# Altium project Pedal_Jacks.PrjPcb
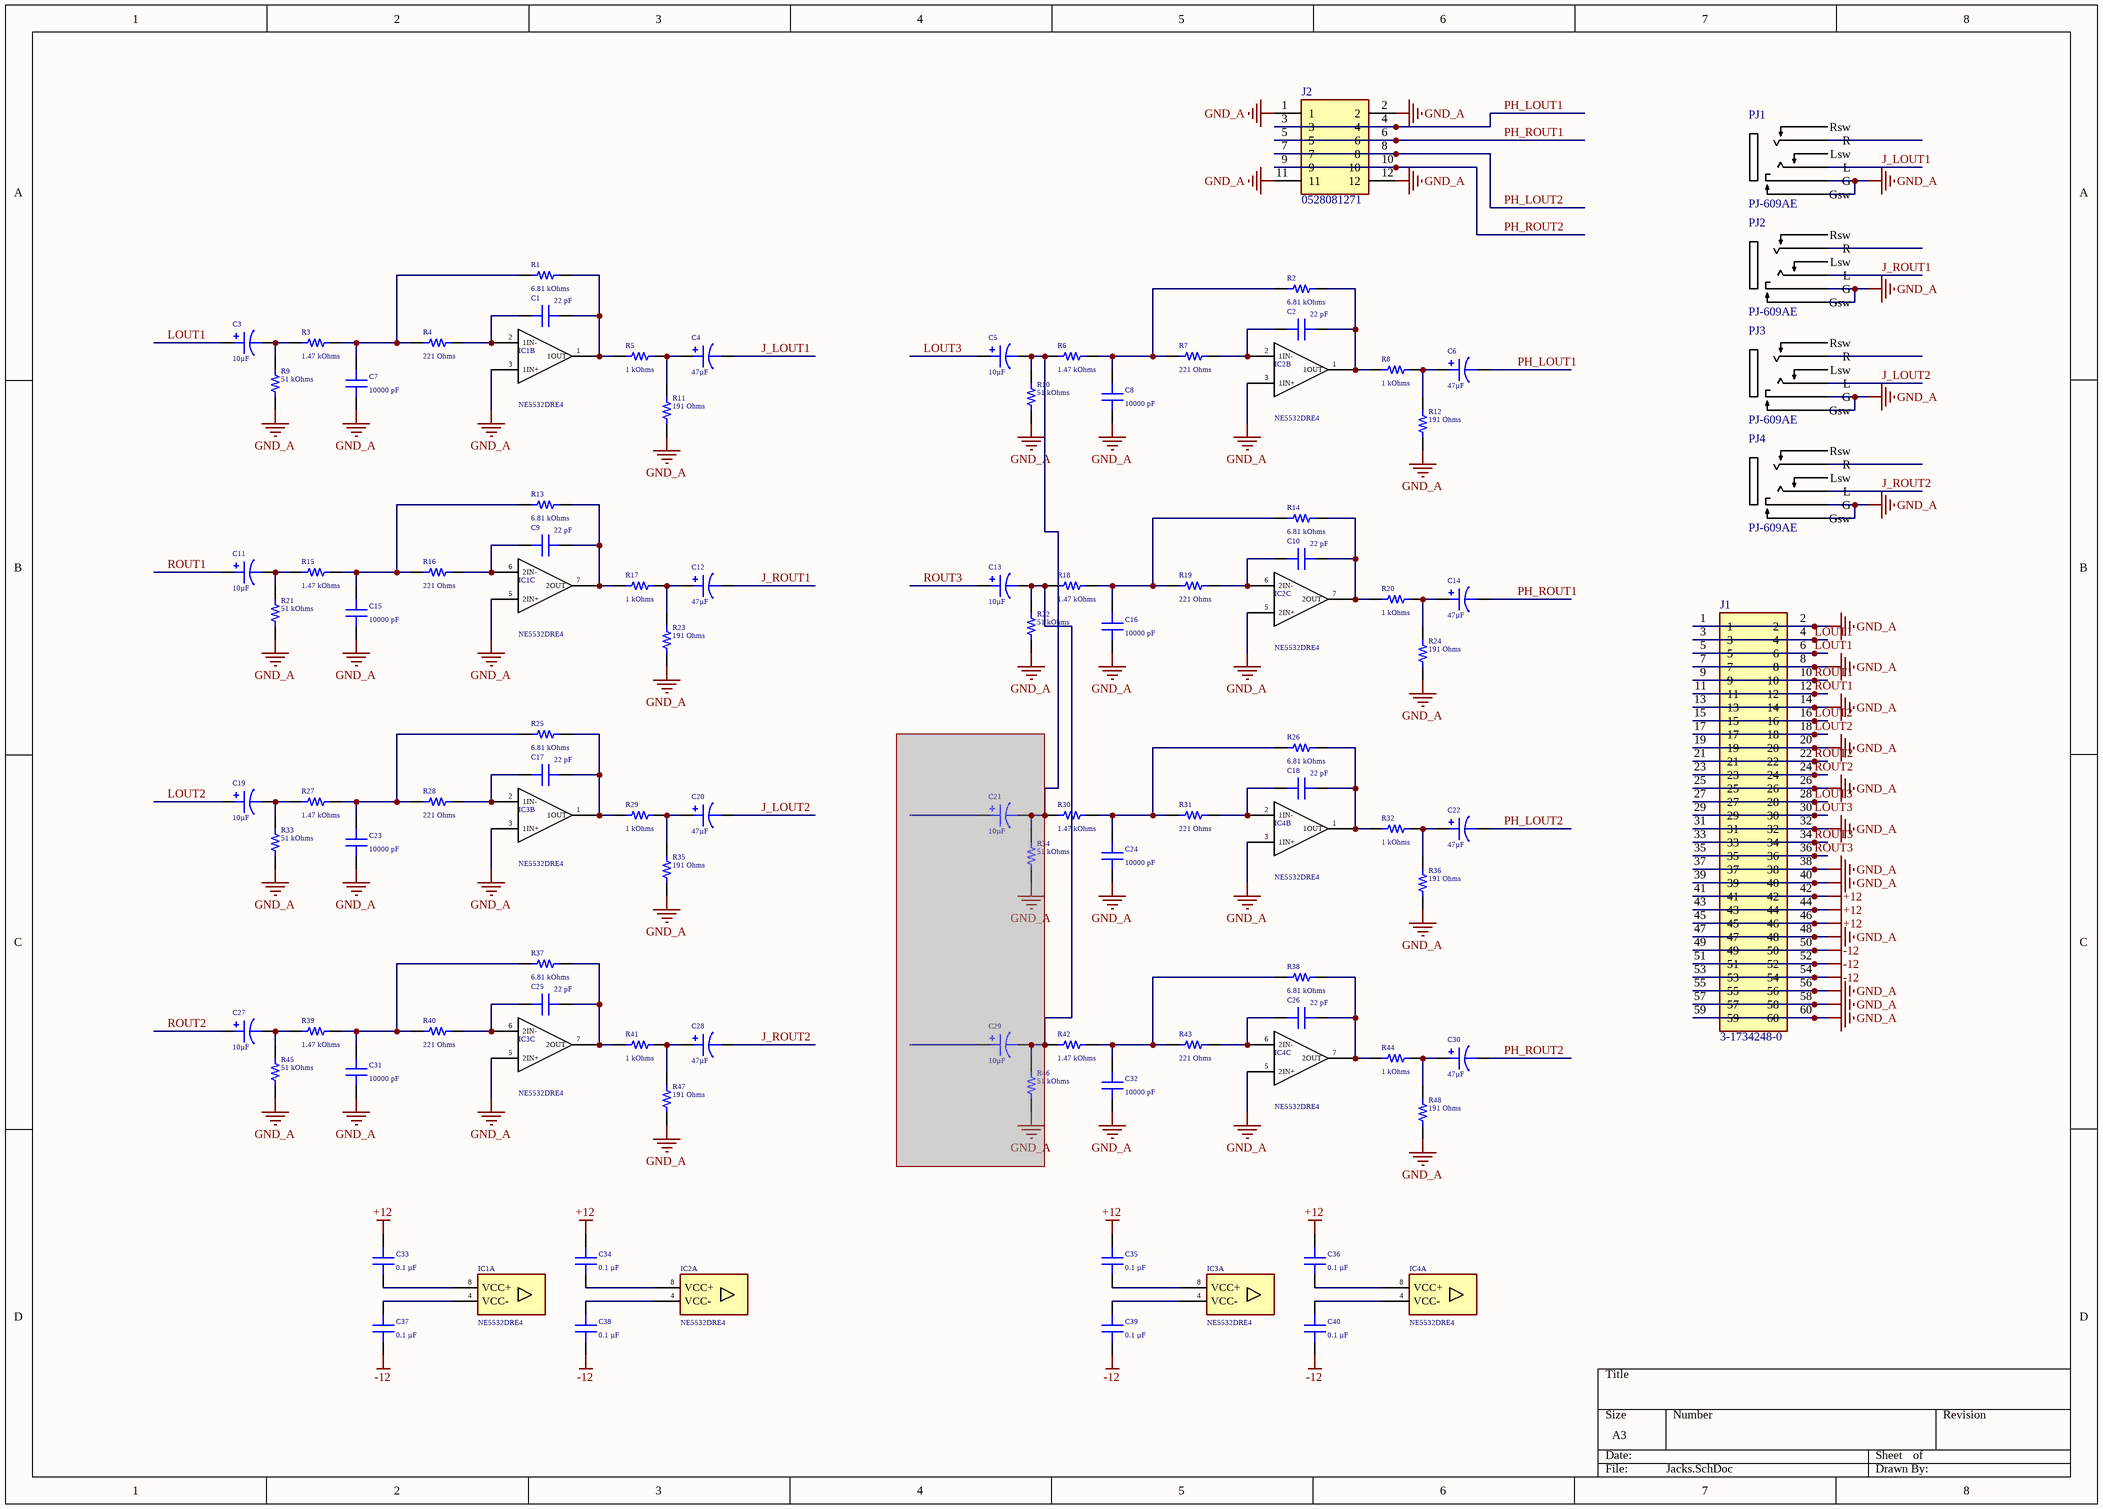
[diagram p0: Jacks.SchDoc]
1 sheet, 98 parts. Net scope: global (net labels, ports and power ports of the same name join across sheets).
Board files: Jacks_old_old.PcbDoc, Jacks_old.PcbDoc, Jacks.PcbDoc

## Sheet Jacks.SchDoc
size A3; SheetNumber: 1; SheetTotal: 1

### Parts
C1  22 pF  [CAP 0603_1608]
C2  22 pF  [CAP 0603_1608]
C3  10µF  [CAP POL 1206_3216]
C4  47µF  [CAP POL 2917_7343]
C5  10µF  [CAP POL 1206_3216]
C6  47µF  [CAP POL 2917_7343]
C7  10000 pF  [MURATA GRM188 0603_1608]
C8  10000 pF  [MURATA GRM188 0603_1608]
C9  22 pF  [CAP 0603_1608]
C10  22 pF  [CAP 0603_1608]
C11  10µF  [CAP POL 1206_3216]
C12  47µF  [CAP POL 2917_7343]
C13  10µF  [CAP POL 1206_3216]
C14  47µF  [CAP POL 2917_7343]
C15  10000 pF  [MURATA GRM188 0603_1608]
C16  10000 pF  [MURATA GRM188 0603_1608]
C17  22 pF  [CAP 0603_1608]
C18  22 pF  [CAP 0603_1608]
C19  10µF  [CAP POL 1206_3216]
C20  47µF  [CAP POL 2917_7343]
C21  10µF  [CAP POL 1206_3216]  (masked out: inside a compile mask, not in the netlist)
C22  47µF  [CAP POL 2917_7343]
C23  10000 pF  [MURATA GRM188 0603_1608]
C24  10000 pF  [MURATA GRM188 0603_1608]
C25  22 pF  [CAP 0603_1608]
C26  22 pF  [CAP 0603_1608]
C27  10µF  [CAP POL 1206_3216]
C28  47µF  [CAP POL 2917_7343]
C29  10µF  [CAP POL 1206_3216]  (masked out: inside a compile mask, not in the netlist)
C30  47µF  [CAP POL 2917_7343]
C31  10000 pF  [MURATA GRM188 0603_1608]
C32  10000 pF  [MURATA GRM188 0603_1608]
C33  0.1 µF  [CAP 0603_1608]
C34  0.1 µF  [CAP 0603_1608]
C35  0.1 µF  [CAP 0603_1608]
C36  0.1 µF  [CAP 0603_1608]
C37  0.1 µF  [CAP 0603_1608]
C38  0.1 µF  [CAP 0603_1608]
C39  0.1 µF  [CAP 0603_1608]
C40  0.1 µF  [CAP 0603_1608]
IC1  NE5532DRE4  [SOIC127P600X175-8N]  (parts A,B,C of 3)
IC2  NE5532DRE4  [SOIC127P600X175-8N]  (parts A,B,C of 3)
IC3  NE5532DRE4  [SOIC127P600X175-8N]  (parts A,B,C of 3)
IC4  NE5532DRE4  [SOIC127P600X175-8N]  (parts A,B,C of 3)
J1  3-1734248-0  [317342480]
J2  0528081271  [AFA11-S12GLA-00]
PJ1  PJ-609AE  [PJ609AE]
PJ2  PJ-609AE  [PJ609AE]
PJ3  PJ-609AE  [PJ609AE]
PJ4  PJ-609AE  [PJ609AE]
R1  6.81 kOhms  [YAGEO RES 0603_1608]
R2  6.81 kOhms  [YAGEO RES 0603_1608]
R3  1.47 kOhms  [YAGEO RES 0603_1608]
R4  221 Ohms  [YAGEO RES 0603_1608]
R5  1 kOhms  [YAGEO RES 0603_1608]
R6  1.47 kOhms  [YAGEO RES 0603_1608]
R7  221 Ohms  [YAGEO RES 0603_1608]
R8  1 kOhms  [YAGEO RES 0603_1608]
R9  51 kOhms  [YAGEO RES 0603_1608]
R10  51 kOhms  [YAGEO RES 0603_1608]
R11  191 Ohms  [YAGEO RES 0603_1608]
R12  191 Ohms  [YAGEO RES 0603_1608]
R13  6.81 kOhms  [YAGEO RES 0603_1608]
R14  6.81 kOhms  [YAGEO RES 0603_1608]
R15  1.47 kOhms  [YAGEO RES 0603_1608]
R16  221 Ohms  [YAGEO RES 0603_1608]
R17  1 kOhms  [YAGEO RES 0603_1608]
R18  1.47 kOhms  [YAGEO RES 0603_1608]
R19  221 Ohms  [YAGEO RES 0603_1608]
R20  1 kOhms  [YAGEO RES 0603_1608]
R21  51 kOhms  [YAGEO RES 0603_1608]
R22  51 kOhms  [YAGEO RES 0603_1608]
R23  191 Ohms  [YAGEO RES 0603_1608]
R24  191 Ohms  [YAGEO RES 0603_1608]
R25  6.81 kOhms  [YAGEO RES 0603_1608]
R26  6.81 kOhms  [YAGEO RES 0603_1608]
R27  1.47 kOhms  [YAGEO RES 0603_1608]
R28  221 Ohms  [YAGEO RES 0603_1608]
R29  1 kOhms  [YAGEO RES 0603_1608]
R30  1.47 kOhms  [YAGEO RES 0603_1608]
R31  221 Ohms  [YAGEO RES 0603_1608]
R32  1 kOhms  [YAGEO RES 0603_1608]
R33  51 kOhms  [YAGEO RES 0603_1608]
R34  51 kOhms  [YAGEO RES 0603_1608]  (masked out: inside a compile mask, not in the netlist)
R35  191 Ohms  [YAGEO RES 0603_1608]
R36  191 Ohms  [YAGEO RES 0603_1608]
R37  6.81 kOhms  [YAGEO RES 0603_1608]
R38  6.81 kOhms  [YAGEO RES 0603_1608]
R39  1.47 kOhms  [YAGEO RES 0603_1608]
R40  221 Ohms  [YAGEO RES 0603_1608]
R41  1 kOhms  [YAGEO RES 0603_1608]
R42  1.47 kOhms  [YAGEO RES 0603_1608]
R43  221 Ohms  [YAGEO RES 0603_1608]
R44  1 kOhms  [YAGEO RES 0603_1608]
R45  51 kOhms  [YAGEO RES 0603_1608]
R46  51 kOhms  [YAGEO RES 0603_1608]  (masked out: inside a compile mask, not in the netlist)
R47  191 Ohms  [YAGEO RES 0603_1608]
R48  191 Ohms  [YAGEO RES 0603_1608]

### Nets
+12: C33.2 C34.2 C35.2 C36.2 J1.41 J1.42 J1.43 J1.44 J1.45 J1.46
-12: C37.1 C38.1 C39.1 C40.1 J1.49 J1.50 J1.51 J1.52 J1.53 J1.54
GND_A: C7.1 C8.1 C15.1 C16.1 C23.1 C24.1 C31.1 C32.1 IC1.3(1IN+) IC1.5(2IN+) IC2.3(1IN+) IC2.5(2IN+) IC3.3(1IN+) IC3.5(2IN+) IC4.3(1IN+) IC4.5(2IN+) J1.1 J1.2 J1.7 J1.8 J1.13 J1.14 J1.19 J1.20 J1.25 J1.26 J1.31 J1.32 J1.37 J1.38 J1.39 J1.40 J1.47 J1.48 J1.55 J1.56 J1.57 J1.58 J1.59 J1.60 J2.1 J2.2 J2.11 J2.12 PJ1.2(G) PJ1.3(Gsw) PJ2.2(G) PJ2.3(Gsw) PJ3.2(G) PJ3.3(Gsw) PJ4.2(G) PJ4.3(Gsw) R9.2 R10.2 R11.1 R12.1 R21.2 R22.2 R23.1 R24.1 R33.2 R35.1 R36.1 R45.2 R47.1 R48.1
J_LOUT1: C4.2 PJ1.6(L)
J_LOUT2: C20.2 PJ3.6(L)
J_ROUT1: C12.2 PJ2.6(L)
J_ROUT2: C28.2 PJ4.6(L)
LOUT1: C3.1 J1.3 J1.4 J1.5 J1.6
LOUT2: C19.1 J1.15 J1.16 J1.17 J1.18
LOUT3: C5.1 J1.27 J1.28 J1.29 J1.30
PH_LOUT1: C6.2 J2.3 J2.4
PH_LOUT2: C22.2 J2.7 J2.8
PH_ROUT1: C14.2 J2.5 J2.6
PH_ROUT2: C30.2 J2.9 J2.10
ROUT1: C11.1 J1.9 J1.10 J1.11 J1.12
ROUT2: C27.1 J1.21 J1.22 J1.23 J1.24
ROUT3: C13.1 J1.33 J1.34 J1.35 J1.36
NetC1_1: C1.1 IC1.1(1OUT) R1.2 R5.1
NetC1_2: C1.2 IC1.2(1IN-) R4.2
NetC2_1: C2.1 IC2.1(1OUT) R2.2 R8.1
NetC2_2: C2.2 IC2.2(1IN-) R7.2
NetC3_2: C3.2 R3.1 R9.1
NetC4_1: C4.1 R5.2 R11.2
NetC5_2: C5.2 R6.1 R10.1 R30.1
NetC6_1: C6.1 R8.2 R12.2
NetC7_2: C7.2 R1.1 R3.2 R4.1
NetC8_2: C8.2 R2.1 R6.2 R7.1
NetC9_1: C9.1 IC1.7(2OUT) R13.2 R17.1
NetC9_2: C9.2 IC1.6(2IN-) R16.2
NetC10_1: C10.1 IC2.7(2OUT) R14.2 R20.1
NetC10_2: C10.2 IC2.6(2IN-) R19.2
NetC11_2: C11.2 R15.1 R21.1
NetC12_1: C12.1 R17.2 R23.2
NetC13_2: C13.2 R18.1 R22.1 R42.1
NetC14_1: C14.1 R20.2 R24.2
NetC15_2: C15.2 R13.1 R15.2 R16.1
NetC16_2: C16.2 R14.1 R18.2 R19.1
NetC17_1: C17.1 IC3.1(1OUT) R25.2 R29.1
NetC17_2: C17.2 IC3.2(1IN-) R28.2
NetC18_1: C18.1 IC4.1(1OUT) R26.2 R32.1
NetC18_2: C18.2 IC4.2(1IN-) R31.2
NetC19_2: C19.2 R27.1 R33.1
NetC20_1: C20.1 R29.2 R35.2
NetC22_1: C22.1 R32.2 R36.2
NetC23_2: C23.2 R25.1 R27.2 R28.1
NetC24_2: C24.2 R26.1 R30.2 R31.1
NetC25_1: C25.1 IC3.7(2OUT) R37.2 R41.1
NetC25_2: C25.2 IC3.6(2IN-) R40.2
NetC26_1: C26.1 IC4.7(2OUT) R38.2 R44.1
NetC26_2: C26.2 IC4.6(2IN-) R43.2
NetC27_2: C27.2 R39.1 R45.1
NetC28_1: C28.1 R41.2 R47.2
NetC30_1: C30.1 R44.2 R48.2
NetC31_2: C31.2 R37.1 R39.2 R40.1
NetC32_2: C32.2 R38.1 R42.2 R43.1
NetC33_1: C33.1 IC1.8(VCC+)
NetC34_1: C34.1 IC2.8(VCC+)
NetC35_1: C35.1 IC3.8(VCC+)
NetC36_1: C36.1 IC4.8(VCC+)
NetC37_2: C37.2 IC1.4(VCC-)
NetC38_2: C38.2 IC2.4(VCC-)
NetC39_2: C39.2 IC3.4(VCC-)
NetC40_2: C40.2 IC4.4(VCC-)

Not connected (* = marked no-connect by the designer): PJ1 4(R) 5(Rsw) 7(Lsw); PJ2 4(R) 5(Rsw) 7(Lsw); PJ3 4(R) 5(Rsw) 7(Lsw); PJ4 4(R) 5(Rsw) 7(Lsw)

### Library data of the parts
C1 C2 C9 C10 C17 C18 C25 C26 = CC0603GRNPO9BN220: CAP CER 22PF 50V C0G/NPO 0603; manufacturer: Yageo; Temperature Coefficient: C0G, NP0; Tolerance: ±2%; Part Number: CC0603GRNPO9BN220; Capacitance: 22 pF; Applications: General Purpose; componentlink1description: Datasheet; componentlink1url: https://www.yageo.com/upload/media/product/productsearch/datasheet/mlcc/UPY-GP_NP0_16V-to-50V_17.pdf; componentlink2description: DigiKey Link; componentlink2url: https://www.digikey.com/en/products/detail/yageo/CC0603GRNPO9BN220/5883550; Device Package: 0603 (1608 Metric); lastupdated: 2/9/2024 8:10:28 PM; Lifecycle Status: Active; Minimum Order: 1; Mounting Type: Surface Mount, MLCC; Operating Temperature: -55°C ~ 125°C; Package / Case: 0603 (1608 Metric); packaging: TapeAndReel; partid: 3677; Part Status: Active; price: 0.01; series: CC; Size / Dimension: 0.063" L x 0.031" W (1.60mm x 0.80mm); Supplier 1: DigiKey; Supplier Part Number 1: 311-3925-1-ND; Thickness (Max): 0.035" (0.90mm); value: 22 pF; Voltage - Rated: 50V
C3 C5 C11 C13 C19 C21 C27 C29 = T491A106K010AT: CAP TANT 10UF 10% 10V 1206; Manufacturer: KEMET; Manufacturer Size Code: A; ESR (Equivalent Series Resistance): 3.8Ohm; Lifetime @ Temp.: 2000 Hrs @ 125°C; Type: Molded; Part Number: T491A106K010AT; Value: 10µF; Capacitance: 10µF; ComponentLink1Description: Datasheet; ComponentLink1URL: https://api.kemet.com/component-edge/download/datasheet/T491A106K010AT.pdf; ComponentLink2Description: DigiKey Link; ComponentLink2URL: http://digikey.com/product-detail/en/kemet/T491A106K010AT/399-3684-1-ND/819009; Device Package: 1206 (3216 Metric); Features: General Purpose; Height - Seated (Max): 0.071" (1.80mm); LastUpdated: 9/2/2020 1:15:58 AM; Lifecycle Status: Active; Minimum Order: 1; Mounting Type: Surface Mount; Operating Temperature: -55°C ~ 125°C; Package / Case: 1206 (3216 Metric); Packaging: TapeAndReel; PartId: 330; Part Status: Active; Price: 0.07; Series: T491; Size / Dimension: 0.126" L x 0.063" W (3.20mm x 1.60mm); Supplier 1: DigiKey; Supplier Part Number 1: 399-3684-1-ND; Tolerance: ±10%; Voltage - Rated: 10V
C4 C6 C12 C14 C20 C22 C28 C30 = 293D476X9010D2TE3: CAP TANT 47UF 10% 10V 2917; Manufacturer: Vishay Sprague; Manufacturer Size Code: D; ESR (Equivalent Series Resistance): 700mOhm; Type: Molded; Part Number: 293D476X9010D2TE3; Value: 47µF; Capacitance: 47µF; ComponentLink1Description: Datasheet; ComponentLink1URL: http://www.vishay.com/docs/40002/293d.pdf; ComponentLink2Description: DigiKey Link; ComponentLink2URL: http://digikey.com/product-detail/en/vishay-sprague/293D476X9010D2TE3/718-1088-1-ND/1559582; Device Package: 2917 (7343 Metric); Features: General Purpose; Height - Seated (Max): 0.122" (3.10mm); LastUpdated: 9/2/2020 1:16:14 AM; Lifecycle Status: Active; Minimum Order: 1; Mounting Type: Surface Mount; Operating Temperature: -55°C ~ 125°C; Package / Case: 2917 (7343 Metric); Packaging: TapeAndReel; PartId: 2778; Part Status: Active; Price: 0.22; Series: TANTAMOUNT®, 293D; Size / Dimension: 0.287" L x 0.169" W (7.30mm x 4.30mm); Supplier 1: DigiKey; Supplier Part Number 1: 718-1088-1-ND; Tolerance: ±10%; Voltage - Rated: 10V
C7 C8 C15 C16 C23 C24 C31 C32 = GRM1885C1H103JA01D: CAP CER 10000PF 50V C0G/NP0 0603; manufacturer: Murata Electronics; Temperature Coefficient: C0G, NP0; Tolerance: ±5%; Part Number: GRM1885C1H103JA01D; Capacitance: 10000 pF; Applications: General Purpose; componentlink1description: Datasheet; componentlink1url: https://www.murata.com/~/media/webrenewal/support/library/catalog/products/capacitor/mlcc/c02e.ashx?la=en-us; componentlink2description: DigiKey Link; componentlink2url: https://www.digikey.com/en/products/detail/murata-electronics/GRM1885C1H103JA01D/4421555; Device Package: 0603 (1608 Metric); lastupdated: 7/20/2024 12:23:21 AM; Lifecycle Status: Active; Minimum Order: 1; Mounting Type: Surface Mount, MLCC; Operating Temperature: -55°C ~ 125°C; Package / Case: 0603 (1608 Metric); packaging: TapeAndReel; partid: 11077; Part Status: Active; price: 0.02; series: GRM; Size / Dimension: 0.063" L x 0.031" W (1.60mm x 0.80mm); Supplier 1: DigiKey; Supplier Part Number 1: 490-9666-1-ND; Thickness (Max): 0.035" (0.90mm); value: 10000 pF; Voltage - Rated: 50V
C33-C40 = C0603C104K5RAC7411: CAP CER 0.1UF 50V X7R 0603; manufacturer: KEMET; Tolerance: ±10%; Part Number: C0603C104K5RAC7411; Value: 0.1 µF; Applications: Bypass, Decoupling; Capacitance: 0.1 µF; componentlink1description: Datasheet; componentlink1url: https://api.kemet.com/component-edge/download/datasheet/C0603C104K5RAC7411.pdf; componentlink2description: DigiKey Link; componentlink2url: https://www.digikey.com/en/products/detail/kemet/C0603C104K5RAC7411/3317013; Device Package: 0603 (1608 Metric); lastupdated: 2/9/2024 8:10:30 PM; Lifecycle Status: Active; Minimum Order: 1; Mounting Type: Surface Mount, MLCC; Operating Temperature: -55°C ~ 125°C; Package / Case: 0603 (1608 Metric); packaging: TapeAndReel; partid: 2233; Part Status: Active; price: 0.01; series: SMD Comm X7R; Size / Dimension: 0.063" L x 0.031" W (1.60mm x 0.80mm); Supplier 1: DigiKey; Supplier Part Number 1: 399-C0603C104K5RAC7411CT-ND; Temperature Coefficient: X7R; Thickness (Max): 0.035" (0.90mm); Voltage - Rated: 50V
IC1-IC4 = NE5532DRE4: Integrated Circuit; Manufacturer_Name: Texas Instruments; Datasheet Link: https://www.ti.com/lit/ds/symlink/ne5532.pdf?HQS=dis-mous-null-mousermode-dsf-pf-null-wwe&ts=1618482303902&ref_url=https%253A%252F%252Fwww.mouser.com%252F; Height: 1.75mm; Manufacturer_Part_Number: NE5532DRE4; Mouser Part Number: 595-NE5532DRE4; Mouser Price/Stock: https://www.mouser.co.uk/ProductDetail/Texas-Instruments/NE5532DRE4?qs=7nS3%252BbEUL6spPf9Rt7S6cg%3D%3D; Arrow Part Number: NE5532DRE4; Arrow Price/Stock: https://www.arrow.com/en/products/ne5532dre4/texas-instruments
J1 = 3-1734248-0: Connector; Manufacturer_Name: TE Connectivity; Datasheet Link: https://www.te.com/commerce/DocumentDelivery/DDEController?Action=srchrtrv&DocNm=5-1773461-0_Standard_FPC_Connectors_QRG&DocType=Data%20Sheet&DocLang=English&PartCntxt=3-1734248-0&DocFormat=pdf; Height: 7.7mm; Manufacturer_Part_Number: 3-1734248-0; Mouser Part Number: 571-3-1734248-0; Mouser Price/Stock: https://www.mouser.co.uk/ProductDetail/TE-Connectivity/3-1734248-0?qs=rVE9j%252BL6g1a4TQRjUuGYiA%3D%3D; Arrow Part Number: 3-1734248-0; Arrow Price/Stock: https://www.arrow.com/en/products/3-1734248-0/te-connectivity; System: Connector
J2 = 0528081271: Connector; Manufacturer_Name: Molex; Datasheet Link: https://www.molex.com/pdm_docs/sd/528082071_sd.pdf; Height: 5.3mm; Manufacturer_Part_Number: 0528081271; System: Connector
PJ1-PJ4 = PJ-609AE: 6.3mm jack HOOYA
R1 R2 R13 R14 R25 R26 R37 R38 = AC0603FR-076K81L: RES SMD 6.81K OHM 1% 1/10W 0603; Manufacturer: Yageo; Power (Watts): 0.1W, 1/10W; Temperature Coefficient: ±100ppm/°C; Part Number: AC0603FR-076K81L; Value: 6.81 kOhms; ComponentLink1Description: Datasheet; ComponentLink1URL: https://www.yageo.com/upload/media/product/productsearch/datasheet/rchip/PYu-AC_51_RoHS_L_7.pdf; ComponentLink2Description: DigiKey Link; ComponentLink2URL: https://www.digikey.com/en/products/detail/yageo/AC0603FR-076K81L/5896265; Composition: Thick Film; Device Package: 0603 (1608 Metric); Features: Automotive AEC-Q200, Moisture Resistant; Height - Seated (Max): 0.022" (0.55mm); LastUpdated: 7/25/2024 9:19:28 AM; Lifecycle Status: Active; Minimum Order: 1; Number of Terminations: 2; Operating Temperature: -55°C ~ 155°C; Package / Case: 0603 (1608 Metric); Packaging: CutTape; PartId: 11704; Part Status: Active; Price: 0.01; Ratings: AEC-Q200; Resistance: 6.81 kOhms; Series: AC; Size / Dimension: 0.063" L x 0.031" W (1.60mm x 0.80mm); Supplier 1: DigiKey; Supplier Part Number 1: YAG3626CT-ND; Supplier Device Package: 0603; Tolerance: ±1%
R3 R6 R15 R18 R27 R30 R39 R42 = AC0603FR-071K47L: RES SMD 1.47K OHM 1% 1/10W 0603; Manufacturer: Yageo; Power (Watts): 0.1W, 1/10W; Temperature Coefficient: ±100ppm/°C; Part Number: AC0603FR-071K47L; Value: 1.47 kOhms; ComponentLink1Description: Datasheet; ComponentLink1URL: https://www.yageo.com/upload/media/product/productsearch/datasheet/rchip/PYu-AC_51_RoHS_L_8.pdf; ComponentLink2Description: DigiKey Link; ComponentLink2URL: https://www.digikey.com/en/products/detail/yageo/AC0603FR-071K47L/5895863; Composition: Thick Film; Device Package: 0603 (1608 Metric); Features: Automotive AEC-Q200, Moisture Resistant; Height - Seated (Max): 0.022" (0.55mm); LastUpdated: 7/25/2024 9:19:11 AM; Lifecycle Status: Active; Minimum Order: 1; Number of Terminations: 2; Operating Temperature: -55°C ~ 155°C; Package / Case: 0603 (1608 Metric); Packaging: CutTape; PartId: 65725; Part Status: Active; Price: 0.01; Ratings: AEC-Q200; Resistance: 1.47 kOhms; Series: AC; Size / Dimension: 0.063" L x 0.031" W (1.60mm x 0.80mm); Supplier 1: DigiKey; Supplier Part Number 1: 13-AC0603FR-071K47LCT-ND; Supplier Device Package: 0603; Tolerance: ±1%
R4 R7 R16 R19 R28 R31 R40 R43 = AC0603FR-07221RL: RES SMD 221 OHM 1% 1/10W 0603; Manufacturer: Yageo; Power (Watts): 0.1W, 1/10W; Temperature Coefficient: ±100ppm/°C; Part Number: AC0603FR-07221RL; Value: 221 Ohms; ComponentLink1Description: Datasheet; ComponentLink1URL: https://www.yageo.com/upload/media/product/productsearch/datasheet/rchip/PYu-AC_51_RoHS_L_10.pdf; ComponentLink2Description: DigiKey Link; ComponentLink2URL: https://www.digikey.com/en/products/detail/yageo/AC0603FR-07221RL/5895921; Composition: Thick Film; Device Package: 0603 (1608 Metric); Features: Automotive AEC-Q200, Moisture Resistant; Height - Seated (Max): 0.022" (0.55mm); LastUpdated: 7/25/2024 9:18:59 AM; Lifecycle Status: Active; Minimum Order: 1; Number of Terminations: 2; Operating Temperature: -55°C ~ 155°C; Package / Case: 0603 (1608 Metric); Packaging: CutTape; PartId: 87217; Price: 0.01; Ratings: AEC-Q200; Resistance: 221 Ohms; Series: AC; Size / Dimension: 0.063" L x 0.031" W (1.60mm x 0.80mm); Supplier 1: DigiKey; Supplier Part Number 1: 13-AC0603FR-07221RLCT-ND; Supplier Device Package: 0603; Tolerance: ±1%
R5 R8 R17 R20 R29 R32 R41 R44 = AA0603FR-071KL: RES SMD 1K OHM 1% 1/10W 0603; Manufacturer: Yageo; Power (Watts): 0.1W, 1/10W; Temperature Coefficient: ±150ppm/°C; Part Number: AA0603FR-071KL; Value: 1 kOhms; ComponentLink1Description: Datasheet; ComponentLink1URL: https://www.yageo.com/upload/media/product/productsearch/datasheet/rchip/PYu-AA_51_RoHS_L_3.pdf; ComponentLink2Description: DigiKey Link; ComponentLink2URL: https://www.digikey.com/en/products/detail/yageo/AA0603FR-071KL/5888847; Composition: Thick Film; Device Package: 0603 (1608 Metric); Features: Anti-Sulfur, Automotive AEC-Q200, Moisture Resistant; Height - Seated (Max): 0.022" (0.55mm); LastUpdated: 7/25/2024 9:19:15 AM; Lifecycle Status: Active; Minimum Order: 1; Number of Terminations: 2; Operating Temperature: -55°C ~ 155°C; Package / Case: 0603 (1608 Metric); Packaging: TapeAndReel; PartId: 64335; Part Status: Active; Price: 0.01; Ratings: AEC-Q200; Resistance: 1 kOhms; Series: AA; Size / Dimension: 0.063" L x 0.031" W (1.60mm x 0.80mm); Supplier 1: DigiKey; Supplier Part Number 1: 13-AA0603FR-071KLCT-ND; Supplier Device Package: 0603; Tolerance: ±1%
R9 R10 R21 R22 R33 R34 R45 R46 = AC0603FR-0751KL: RES SMD 51K OHM 1% 1/10W 0603; Manufacturer: Yageo; Power (Watts): 0.1W, 1/10W; Temperature Coefficient: ±100ppm/°C; Part Number: AC0603FR-0751KL; Value: 51 kOhms; ComponentLink1Description: Datasheet; ComponentLink1URL: https://www.yageo.com/upload/media/product/productsearch/datasheet/rchip/PYu-AC_51_RoHS_L_7.pdf; ComponentLink2Description: DigiKey Link; ComponentLink2URL: https://www.digikey.com/en/products/detail/yageo/AC0603FR-0751KL/5896179; Composition: Thick Film; Device Package: 0603 (1608 Metric); Features: Automotive AEC-Q200, Moisture Resistant; Height - Seated (Max): 0.022" (0.55mm); LastUpdated: 7/25/2024 9:19:23 AM; Lifecycle Status: Active; Minimum Order: 1; Number of Terminations: 2; Operating Temperature: -55°C ~ 155°C; Package / Case: 0603 (1608 Metric); Packaging: CutTape; PartId: 17419; Part Status: Active; Price: 0.01; Ratings: AEC-Q200; Resistance: 51 kOhms; Series: AC; Size / Dimension: 0.063" L x 0.031" W (1.60mm x 0.80mm); Supplier 1: DigiKey; Supplier Part Number 1: YAG3616CT-ND; Supplier Device Package: 0603; Tolerance: ±1%
R11 R12 R23 R24 R35 R36 R47 R48 = AC0603FR-07191RL: RES SMD 191 OHM 1% 1/10W 0603; Manufacturer: Yageo; Power (Watts): 0.1W, 1/10W; Temperature Coefficient: ±100ppm/°C; Part Number: AC0603FR-07191RL; Value: 191 Ohms; ComponentLink1Description: Datasheet; ComponentLink1URL: https://www.yageo.com/upload/media/product/productsearch/datasheet/rchip/PYu-AC_51_RoHS_L_9.pdf; ComponentLink2Description: DigiKey Link; ComponentLink2URL: https://www.digikey.com/en/products/detail/yageo/AC0603FR-07191RL/5895841; Composition: Thick Film; Device Package: 0603 (1608 Metric); Features: Automotive AEC-Q200, Moisture Resistant; Height - Seated (Max): 0.022" (0.55mm); LastUpdated: 7/25/2024 9:19:07 AM; Lifecycle Status: Active; Minimum Order: 1; Number of Terminations: 2; Operating Temperature: -55°C ~ 155°C; Package / Case: 0603 (1608 Metric); Packaging: CutTape; PartId: 72108; Part Status: Active; Price: 0.01; Ratings: AEC-Q200; Resistance: 191 Ohms; Series: AC; Size / Dimension: 0.063" L x 0.031" W (1.60mm x 0.80mm); Supplier 1: DigiKey; Supplier Part Number 1: 13-AC0603FR-07191RLCT-ND; Supplier Device Package: 0603; Tolerance: ±1%